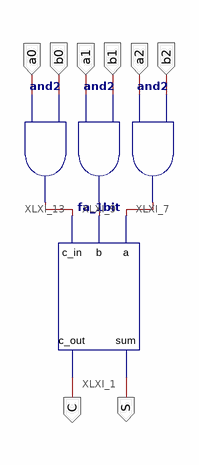
[diagram p0: schematic sheet 1]
// Xilinx ISE schematic mul_fa.sch (spartan3e) as structural Verilog: 4 symbols, 8 ports
module mul_fa (
  input  a0,
  input  b0,
  input  a1,
  input  b1,
  input  a2,
  input  b2,
  output C,
  output S
);

  wire XLXN_13, XLXN_18, XLXN_19;

  fa_1bit XLXI_1 (.a(XLXN_13), .b(XLXN_19), .c_in(XLXN_18), .sum(S), .c_out(C));
  and XLXI_7 (XLXN_13, a2, b2);
  and XLXI_9 (XLXN_19, a1, b1);
  and XLXI_13 (XLXN_18, a0, b0);
endmodule
